# EAGLE schematic NEW_POT (EAGLE 7.5.0)
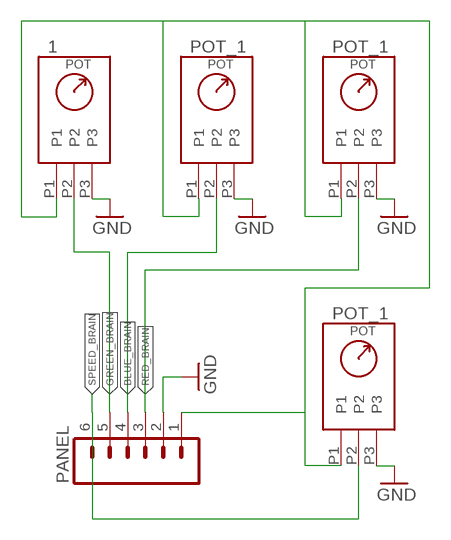
[diagram p0: schematic, sheet 1]

## Parts
DAS  1  POT_1  [POT_1]
PANEL  M06NO_SILK_FEMALE_PTH  [1X06_NO_SILK]
U$2  POT_1  [POT_1]
U$3  POT_1  [POT_1]
U$4  POT_1  [POT_1]

## Nets
BLUE_BRAIN: PANEL.4 U$2.P2
GND: DAS.P3 PANEL.2 U$2.P3 U$3.P3 U$4.P3
GREEN_BRAIN: DAS.P2 PANEL.5
RED_BRAIN: PANEL.3 U$3.P2
SPEED_BRAIN: PANEL.6 U$4.P2
V_5V: DAS.P1 PANEL.1 U$2.P1 U$3.P1 U$4.P1

## Library data of the parts
DAS U$2-U$4 = RodrigoMarques_Parts:POT_1
PANEL = SparkFun-Connectors:M06: Header 6 Standard 6-pin 0.1" header. Use with straight break away headers (SKU : PRT-00116), right angle break away headers (PRT-00553), swiss pins (PRT-00743), machine pins (PRT-00117), and female headers (PRT-00115). Molex polarized connector foot print use with SKU : PRT-08094 with associated crimp pins and housings. NOTES ON THE VARIANTS LOCK and LOCK_LONGPADS... This footprint was designed to help hold the alignment of a through-hole component (i.e. 6-pin header) while soldering it into place. You may notice that each hole has been shifted either up or down by 0.005 of an inch from it's more standard position (which is a perfectly straight line). This slight alteration caused the pins (the squares in the middle) to touch the edges of the holes. Because they are alternating, it causes a "brace" to hold the component in place. 0.005 has proven to be the perfect amount of "off-center" position when using our standard breakaway headers. Although looks a little odd when you look at the bare footprint, once you have a header in there, the alteration is very hard to notice. Also,if you push a header all the way into place, it is covered up entirely on the bottom side. This idea of altering the position of holes to aid alignment will be further integrated into the Sparkfun Library for other footprints. It can help hold any component with 3 or more connection pins.; PROD_ID: CONN-08437

## Net classes
0 default: width 0.254 mm